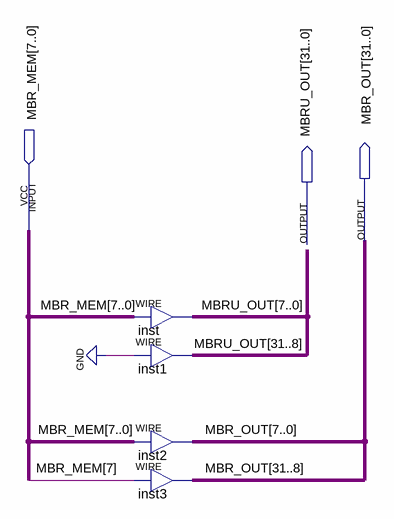
[diagram p0: schematic sheet]
// Quartus schematic mbr_extensor.bdf as structural Verilog: 4 symbols, 3 pins
module mbr_extensor (
  input  [7:0] MBR_MEM,
  output [31:0] MBR_OUT,
  output [31:0] MBRU_OUT
);

  assign MBRU_OUT[7:0] = MBR_MEM;  // WIRE inst
  assign MBRU_OUT[31:8] = {24{1'b0}};  // WIRE inst1
  assign MBR_OUT[7:0] = MBR_MEM;  // WIRE inst2
  assign MBR_OUT[31:8] = {24{MBR_MEM[7]}};  // WIRE inst3
endmodule
